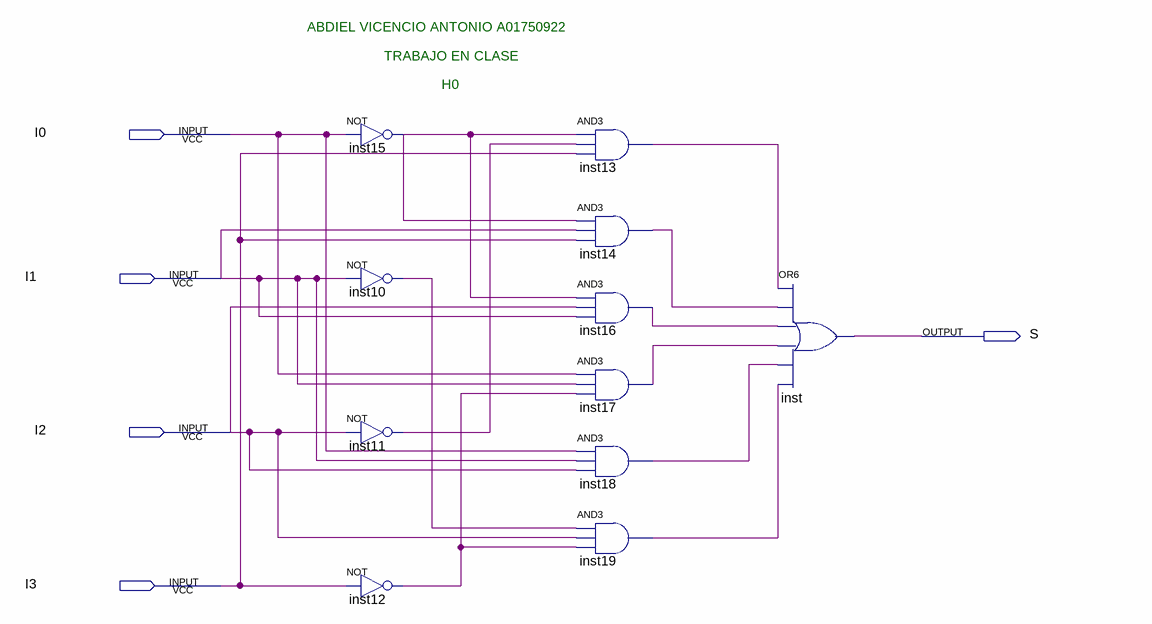
[diagram p0: schematic sheet]
// Quartus schematic H0.bdf as structural Verilog: 11 symbols, 5 pins
module H0 (
  input  I0,
  input  I1,
  input  I2,
  input  I3,
  output S
);

  wire inst10_out, inst11_out, inst12_out, inst13_out, inst14_out, inst15_out, inst16_out, inst17_out,
       inst18_out, inst19_out;

  not inst15 (inst15_out, I0);
  not inst10 (inst10_out, I1);
  not inst11 (inst11_out, I2);
  not inst12 (inst12_out, I3);
  and inst13 (inst13_out, inst15_out, inst11_out, I3);
  and inst14 (inst14_out, inst15_out, I1, I3);
  and inst16 (inst16_out, inst15_out, I2, I1);
  and inst17 (inst17_out, I0, I1, inst12_out);
  and inst18 (inst18_out, I0, I1, I2);
  and inst19 (inst19_out, inst10_out, I2, inst12_out);
  or inst (S, inst13_out, inst14_out, inst16_out, inst17_out, inst18_out, inst19_out);

  // Notes on the sheet:
  //   ABDIEL VICENCIO ANTONIO A01750922
  //   TRABAJO EN CLASE
  //   H0
endmodule
